# Altium schematic sheet usb.SchDoc
size A; SheetNumber: 2; SheetTotal: 3
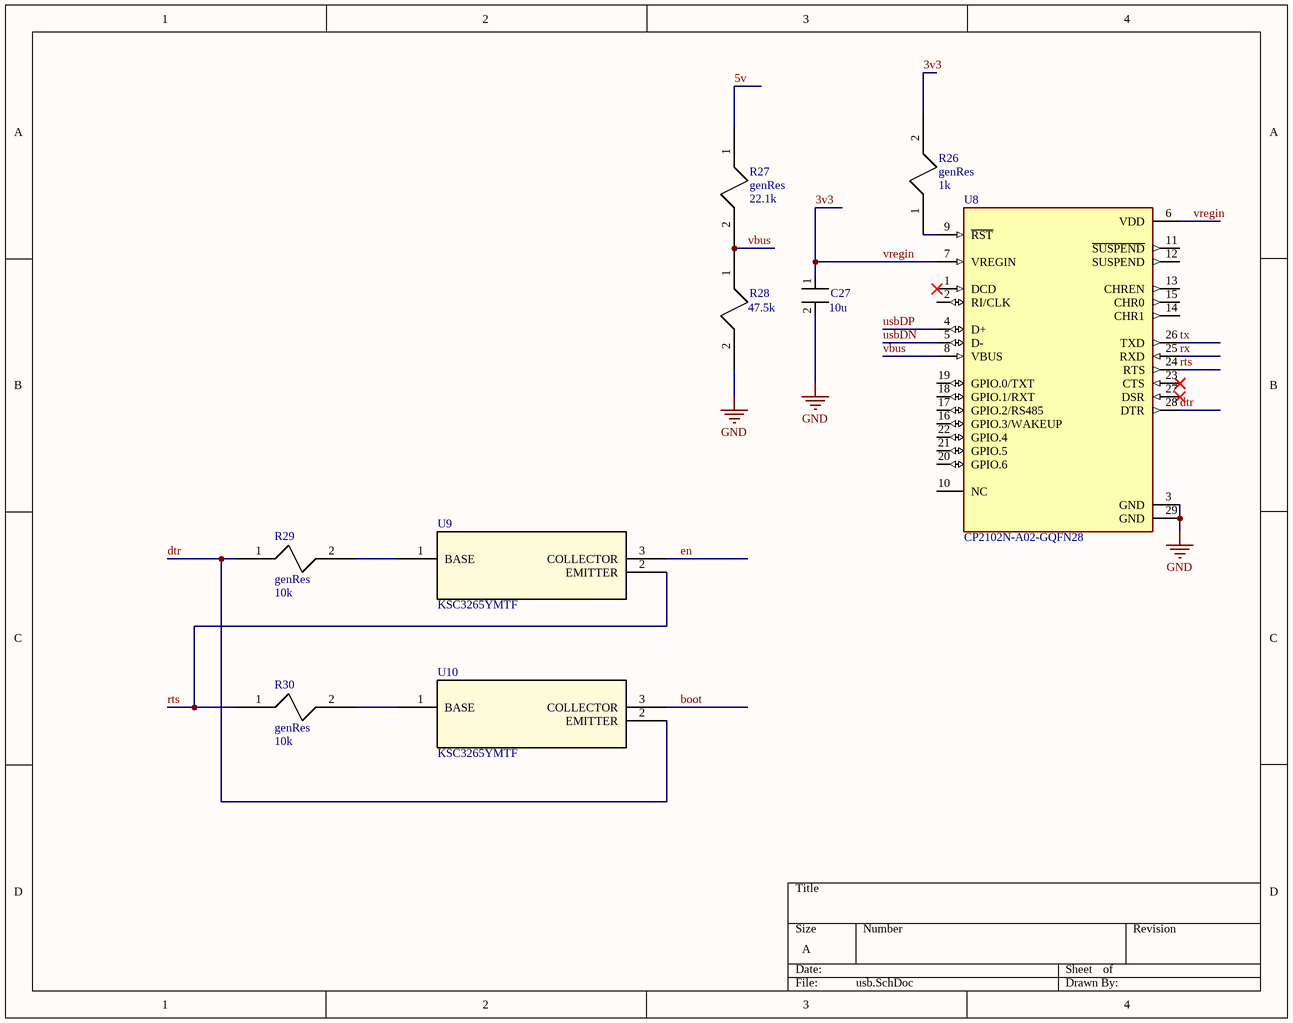
[diagram p0: usb.SchDoc]

## Parts
C27  C: 10u  [GeneralCap]  (hidden comment: genCap)
R26  genRes  R: 1k  [GeneralCap]
R27  genRes  R: 22.1k  [GeneralCap]
R28  R: 47.5k  [GeneralCap]  (hidden comment: genRes)
R29  genRes  R: 10k  [GeneralCap]
R30  genRes  R: 10k  [GeneralCap]
U8  CP2102N-A02-GQFN28  [QFN50P500X500X80-29N]
U9  KSC3265YMTF  [SOT-23_ONS]
U10  KSC3265YMTF  [SOT-23_ONS]

## Nets
GND: C27.2 R28.2 U8.3(GND) U8.29(GND)
3v3: C27.1 R26.2 U8.6(VDD) U8.7(VREGIN)  [also labelled vregin]
5v: R27.1
boot: U10.3(COLLECTOR)
dtr: R29.1 U8.28(DTR) U10.2(EMITTER)
en: U9.3(COLLECTOR)
rts: R30.1 U8.24(RTS) U9.2(EMITTER)
rx: U8.25(RXD)
tx: U8.26(TXD)
usbDN: U8.5(D-)
usbDP: U8.4(D+)
vbus: R27.2 R28.1 U8.8(VBUS)
NetR26_1: R26.1 U8.9(~{RST})
NetR29_2: R29.2 U9.1(BASE)
NetR30_2: R30.2 U10.1(BASE)

Not connected (* = marked no-connect by the designer): U8 1(DCD)* 2(RI/CLK) 10(NC) 11(~{SUSPEND}) 12(SUSPEND) 13(CHREN) 14(CHR1) 15(CHR0) 16(GPIO.3/WAKEUP) 17(GPIO.2/RS485) 18(GPIO.1/RXT) 19(GPIO.0/TXT) 20(GPIO.6) 21(GPIO.5) 22(GPIO.4) 23(CTS)* 27(DSR)*

## Library data of the parts
C27 = genCap: C6119842
R26 = genRes: C22548
R27 = genRes: C137768
R28 = genRes: C705990
R29 R30 = genRes: C98220
U8 = CP2102N-A02-GQFN28: C1550553; MF: Silicon Labs; Value: *; Price: None; Package: WFQFN-28 Silicon Labs; Check_prices: https://www.snapeda.com/parts/CP2102N-A02-GQFN28/Silicon+Labs/view-part/?ref=eda; Availability: In Stock; SnapEDA_Link: https://www.snapeda.com/parts/CP2102N-A02-GQFN28/Silicon+Labs/view-part/?ref=snap; Purchase-URL: https://pricing.snapeda.com/search/part/CP2102N-A02-GQFN28/?ref=eda; MP: CP2102N-A02-GQFN28
U9 U10 = KSC3265YMTF: C14809; Mfr_Name: onsemi; RefDes: RefDes; Type: Type